# Altium schematic sheet Breadboard Prototyping Schematic.SchDoc: Breadboard Prototype Schematic
size B; DrawnBy: Jasper Yun; SheetNumber: 12; SheetTotal: 11; Competition: SAC 2021; Subteam: Avionics; University: McGill University; Location: Montreal, Quebec; Project: Avionics Project Name; MRT: McGill Rocket Team
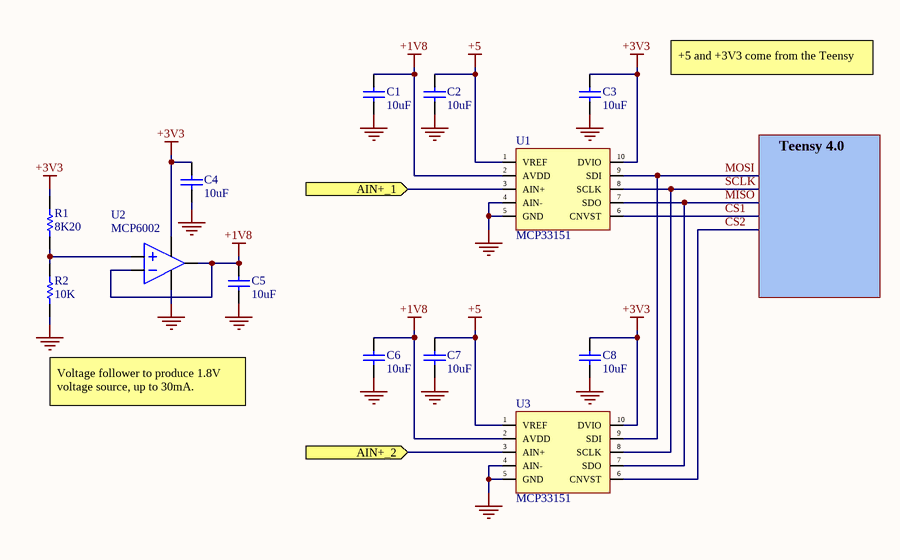
[diagram p0: Breadboard Prototyping Schematic.SchDoc]

## Parts
C1  10uF  [RAD-0.3]
C2  10uF  [RAD-0.3]
C3  10uF  [RAD-0.3]
C4  10uF  [RAD-0.3]
C5  10uF  [RAD-0.3]
C6  10uF  [RAD-0.3]
C7  10uF  [RAD-0.3]
C8  10uF  [RAD-0.3]
R1  8K20  [AXIAL-0.3]
R2  10K  [AXIAL-0.3]
U1  MCP33151  [MSOP-10]
U2  MCP6002
U3  MCP33151  [MSOP-10]

## Ports
AIN+_1 (in), AIN+_2 (in)

## Nets
+1V8: C1.1 C5.2 C6.1 U1.2(AVDD) U2.2 U2.5 U3.2(AVDD)
+3V3: C3.1 C4.2 C8.1 R1.2 U1.10(DVIO) U2.4 U3.10(DVIO)
+5: C2.1 C7.1 U1.1(VREF) U3.1(VREF)
GND: C1.2 C2.2 C3.2 C4.1 C5.1 C6.2 C7.2 C8.2 R2.1 U1.4(AIN-) U1.5(GND) U2.3 U3.4(AIN-) U3.5(GND)
AIN+_1: U1.3(AIN+) ; port AIN+_1
AIN+_2: U3.3(AIN+) ; port AIN+_2
CS1: U1.6(CNVST)
CS2: U3.6(CNVST)
MISO: U1.7(SDO) U3.7(SDO)
MOSI: U1.9(SDI) U3.9(SDI)
SCLK: U1.8(SCLK) U3.8(SCLK)
NetR1_1: R1.1 R2.2 U2.1

## Notes on the sheet
- +5 and +3V3 come from the Teensy
- Teensy 4.0
- Voltage follower to produce 1.8V voltage source, up to 30mA.
- Title
- Size:
- Date:
- B
- Revision:
- Time:
- Drawn By:
- Sheet
- of
- File:

## Library data of the parts
C1-C8 = Cap: Capacitor; Value: 100Nf; Published: 8-Jun-2000; LatestRevisionDate: 17-Jul-2002; LatestRevisionNote: Re-released for DXP Platform.; PackageReference: RAD-0.3; Publisher: Altium Limited; PackageDescription: Radial Cap, Thru-Hole; 2 Leads; 0.3 in Pin Spacing
R1 R2 = Res1: Resistor; Value: 1K; Published: 8-Jun-2000; LatestRevisionDate: 17-Jul-2002; LatestRevisionNote: Re-released for DXP Platform.; PackageReference: AXIAL-0.3; Publisher: Altium Limited; PackageDescription: Axial Device, Thru-Hole; 2 Leads; 0.3 in Pin Spacing
U1 U3 = ADC MCP33151: ADC 14-bit SAR 1Msps 10-MSOP; Manufacturer: Microchip; Manufacturer Part Number: MCP33151-10-E/MS; Supplier 1: Arrow Electronics; RoHS: No; Category: Analog to Digital Converters (ADCs); Stock 1: 90; Pricing 1: 1=2.20600 (USD); Supplier Part Number 1: MCP33151-10-E/MS
U2 = Op Amp: Generic Op Amp